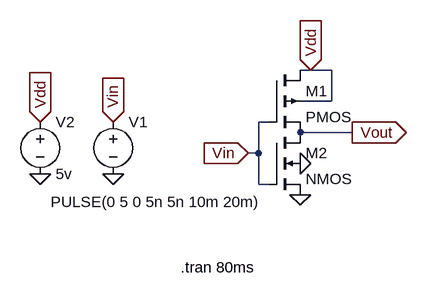
[diagram p0: schematic CMOS Invert.asc]
CMOS Invert.asc, the LTspice schematic file:
Version 4.1
SHEET 1 880 680
WIRE 224 64 208 64
WIRE 256 64 224 64
WIRE 256 112 256 64
WIRE 256 112 208 112
WIRE 160 144 144 144
WIRE 288 160 208 160
WIRE 144 192 144 144
WIRE 144 192 128 192
WIRE 144 240 144 192
WIRE 160 240 144 240
FLAG 208 256 0
FLAG 208 208 0
FLAG 288 160 Vout
IOPIN 288 160 Out
FLAG -80 224 0
FLAG -80 144 Vin
IOPIN -80 144 In
FLAG 128 192 Vin
IOPIN 128 192 In
FLAG -192 224 0
FLAG -192 144 Vdd
IOPIN -192 144 In
FLAG 224 64 Vdd
IOPIN 224 64 In
SYMBOL pmos4 160 64 R0
SYMATTR InstName M1
SYMBOL nmos4 160 160 R0
SYMATTR InstName M2
SYMBOL voltage -80 128 R0
WINDOW 3 -96 139 Left 2
WINDOW 123 0 0 Left 0
WINDOW 39 0 0 Left 0
SYMATTR InstName V1
SYMATTR Value PULSE(0 5 0 5n 5n 10m 20m)
SYMBOL voltage -192 128 R0
WINDOW 123 0 0 Left 0
WINDOW 39 0 0 Left 0
SYMATTR InstName V2
SYMATTR Value 5v
TEXT 24 368 Left 2 !.tran 80ms

The netlist it stands for:
* CMOS Invert.asc
M1 Vdd Vin Vout Vdd PMOS
M2 Vout Vin 0 0 NMOS
V1 Vin 0 PULSE(0 5 0 5n 5n 10m 20m)
V2 Vdd 0 5v
.model NMOS NMOS
.model PMOS PMOS
.lib standard.mos
.tran 80ms
.backanno
.end